# Altium schematic sheet siglabs-misc1.SchDoc
size Letter; CompanyName: Brinton Engineering, LLC; Address1: 3479 Edison Way; Address2: Menlo Park CA 94025; Address3: +1 (877) 778-8435; Address4: brintonengineering.com; Revision: 1; SheetNumber: 1; SheetTotal: 1
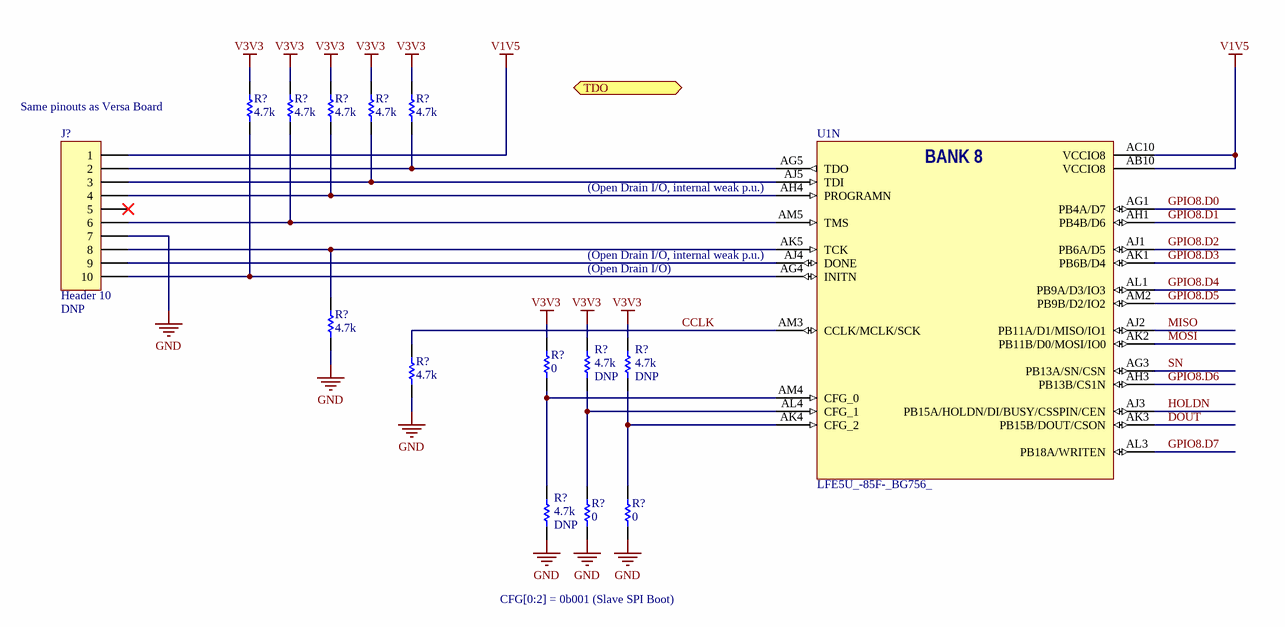
[diagram p0: siglabs-misc1.SchDoc]

## Parts
(Parts that share a designator on the sheet are numbered #1, #2 ... from top to bottom, then left to right.)
J?  Header 10  Do Not Place: DNP  [HDR1X10]
R?#1  value 4.7k  [0603]  (hidden comment: RES 0603 4.7k 1%)
R?#2  value 4.7k  [0603]  (hidden comment: RES 0603 4.7k 1%)
R?#3  value 4.7k  [0603]  (hidden comment: RES 0603 4.7k 1%)
R?#4  value 4.7k  [0603]  (hidden comment: RES 0603 4.7k 1%)
R?#5  value 4.7k  [0603]  (hidden comment: RES 0603 4.7k 1%)
R?#6  value 4.7k  [0603]  (hidden comment: RES 0603 4.7k 1%)
R?#7  value 0  [0603]  (hidden comment: RES 0603 0)
R?#8  value 4.7k  Do Not Place: DNP  [0603]  (hidden comment: RES 0603 4.7k 1%)
R?#9  value 4.7k  Do Not Place: DNP  [0603]  (hidden comment: RES 0603 4.7k 1%)
R?#10  value 4.7k  [0603]  (hidden comment: RES 0603 4.7k 1%)
R?#11  value 4.7k  Do Not Place: DNP  [0603]  (hidden comment: RES 0603 4.7k 1%)
R?#12  value 0  [0603]  (hidden comment: RES 0603 0)
R?#13  value 0  [0603]  (hidden comment: RES 0603 0)
U1  LFE5U_-85F-_BG756_  [caBGA756]  (part N of 19)

## Ports
TDO (out)

## Nets
GND: J?.7 R?#6.1 R?#10.1 R?#11.1 R?#12.1 R?#13.1
V1V5: J?.1 U1.AB10(VCCIO8) U1.AC10(VCCIO8)
V3V3: R?#1.2 R?#2.2 R?#3.2 R?#4.2 R?#5.2 R?#7.2 R?#8.2 R?#9.2
CCLK: R?#10.2 U1.AM3(CCLK/MCLK/SCK)
DOUT: U1.AK3(PB15B/DOUT/CSON)
GPIO8.D0: U1.AG1(PB4A/D7)
GPIO8.D1: U1.AH1(PB4B/D6)
GPIO8.D2: U1.AJ1(PB6A/D5)
GPIO8.D3: U1.AK1(PB6B/D4)
GPIO8.D4: U1.AL1(PB9A/D3/IO3)
GPIO8.D5: U1.AM2(PB9B/D2/IO2)
GPIO8.D6: U1.AH3(PB13B/CS1N)
GPIO8.D7: U1.AL3(PB18A/WRITEN)
HOLDN: U1.AJ3(PB15A/HOLDN/DI/BUSY/CSSPIN/CEN)
MISO: U1.AJ2(PB11A/D1/MISO/IO1)
MOSI: U1.AK2(PB11B/D0/MOSI/IO0)
SN: U1.AG3(PB13A/SN/CSN)
NetJ?_2: J?.2 R?#5.1 U1.AG5(TDO)
NetJ?_3: J?.3 R?#4.1 U1.AJ5(TDI)
NetJ?_4: J?.4 R?#3.1 U1.AH4(PROGRAMN)
NetJ?_6: J?.6 R?#2.1 U1.AM5(TMS)
NetJ?_8: J?.8 R?#6.2 U1.AK5(TCK)
NetJ?_9: J?.9 U1.AJ4(DONE)
NetJ?_10: J?.10 R?#1.1 U1.AG4(INITN)
NetR?#7_1: R?#7.1 R?#11.2 U1.AM4(CFG_0)
NetR?#8_1: R?#8.1 R?#12.2 U1.AL4(CFG_1)
NetR?#9_1: R?#9.1 R?#13.2 U1.AK4(CFG_2)

Not connected (* = marked no-connect by the designer): J? 5*

## Notes on the sheet
- (near J?) Same pinouts as Versa Board
- (near U1) (Open Drain I/O, internal weak p.u.)
- (Open Drain I/O)
- CFG[0:2] = 0b001 (Slave SPI Boot)
- Title
- Engineer
- Revision
- Drawn By
- Checked By
- Date
- Sheet
- of
- (in symbol LFE5U_-85F-_BG756_, part N) BANK 8

## Library data of the parts
J? = Header 10: Header, 10-Pin; LatestRevisionDate: 17-Jul-2002; LatestRevisionNote: Re-released for DXP Platform.; Publisher: Altium Limited
R?#1-R?#6 R?#8-R?#11 = RES 0603 10k 1%: Thick Film Resistor 4.7k Ohms +/-1% 0.1W 75V SMD 0603; Manufacturer: Panasonic - ECG; Manufacturer P/N: ERJ3EKF4701V; Tcr: +/-100; Tr: -55:+155; Tolerance: +/-1%; Alternatives: *; Voltage: 75V; Power: 0.1W; P/N: ERJ3EKF4701V
R?#7 R?#12 R?#13 = RES 0603 10k 1%: Thick Film Resistor 0 Ohms SMD 0603; Manufacturer: Panasonic - ECG; Manufacturer P/N: ERJ-3GEY0R00V; Tcr: +/-100; Tolerance: +/-1%; Tr: -55:+155; Voltage: 75V; Power: 0.1W; Alternatives: *; P/N: ERJ-3GEY0R00V
U1 = LFE5U_-85F-_BG756_: ECP5 FPGA, 85k LUT, 756-caBGA; Manufacturer: Lattice Semiconductor; Manufacturer P/N: LFE5U_-85F-_BG756_